# Altium schematic sheet C-metr_analog.SchDoc
size 800 x 500 mm
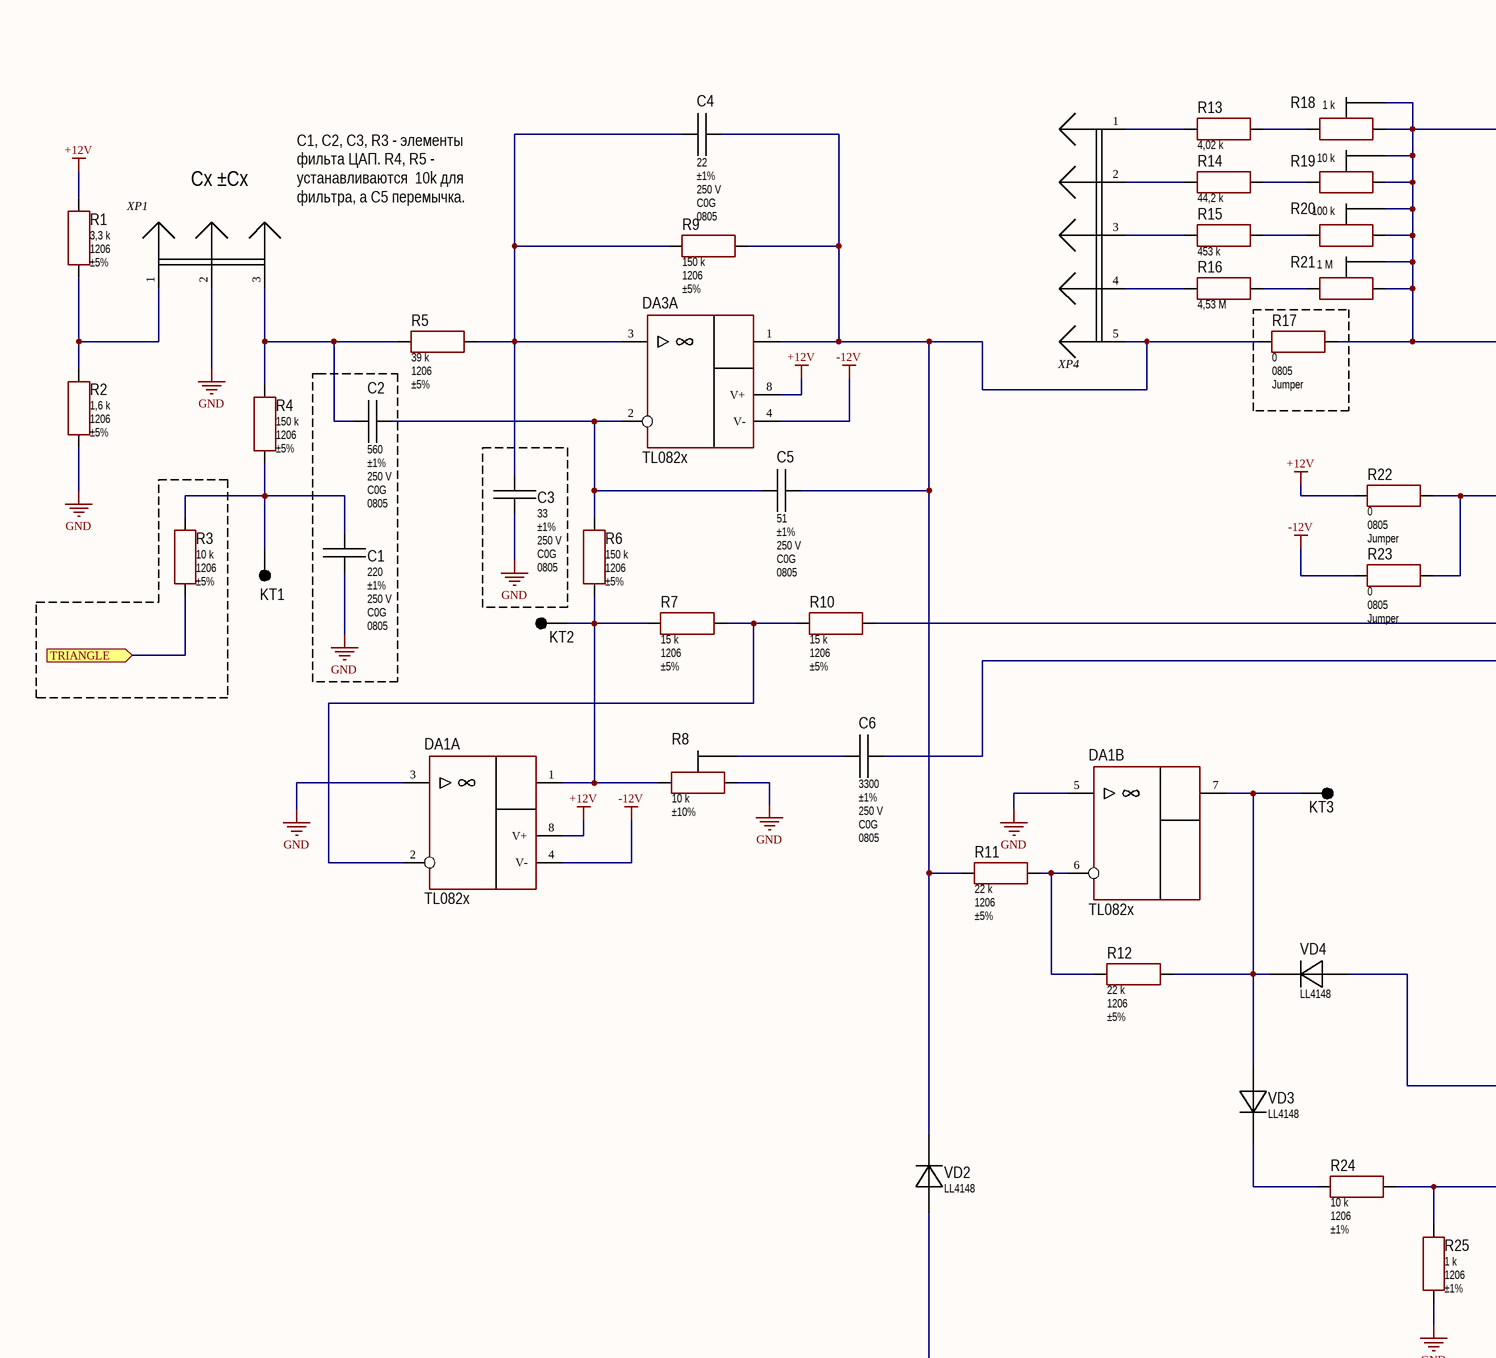
[diagram p0: C-metr_analog.SchDoc, top left]
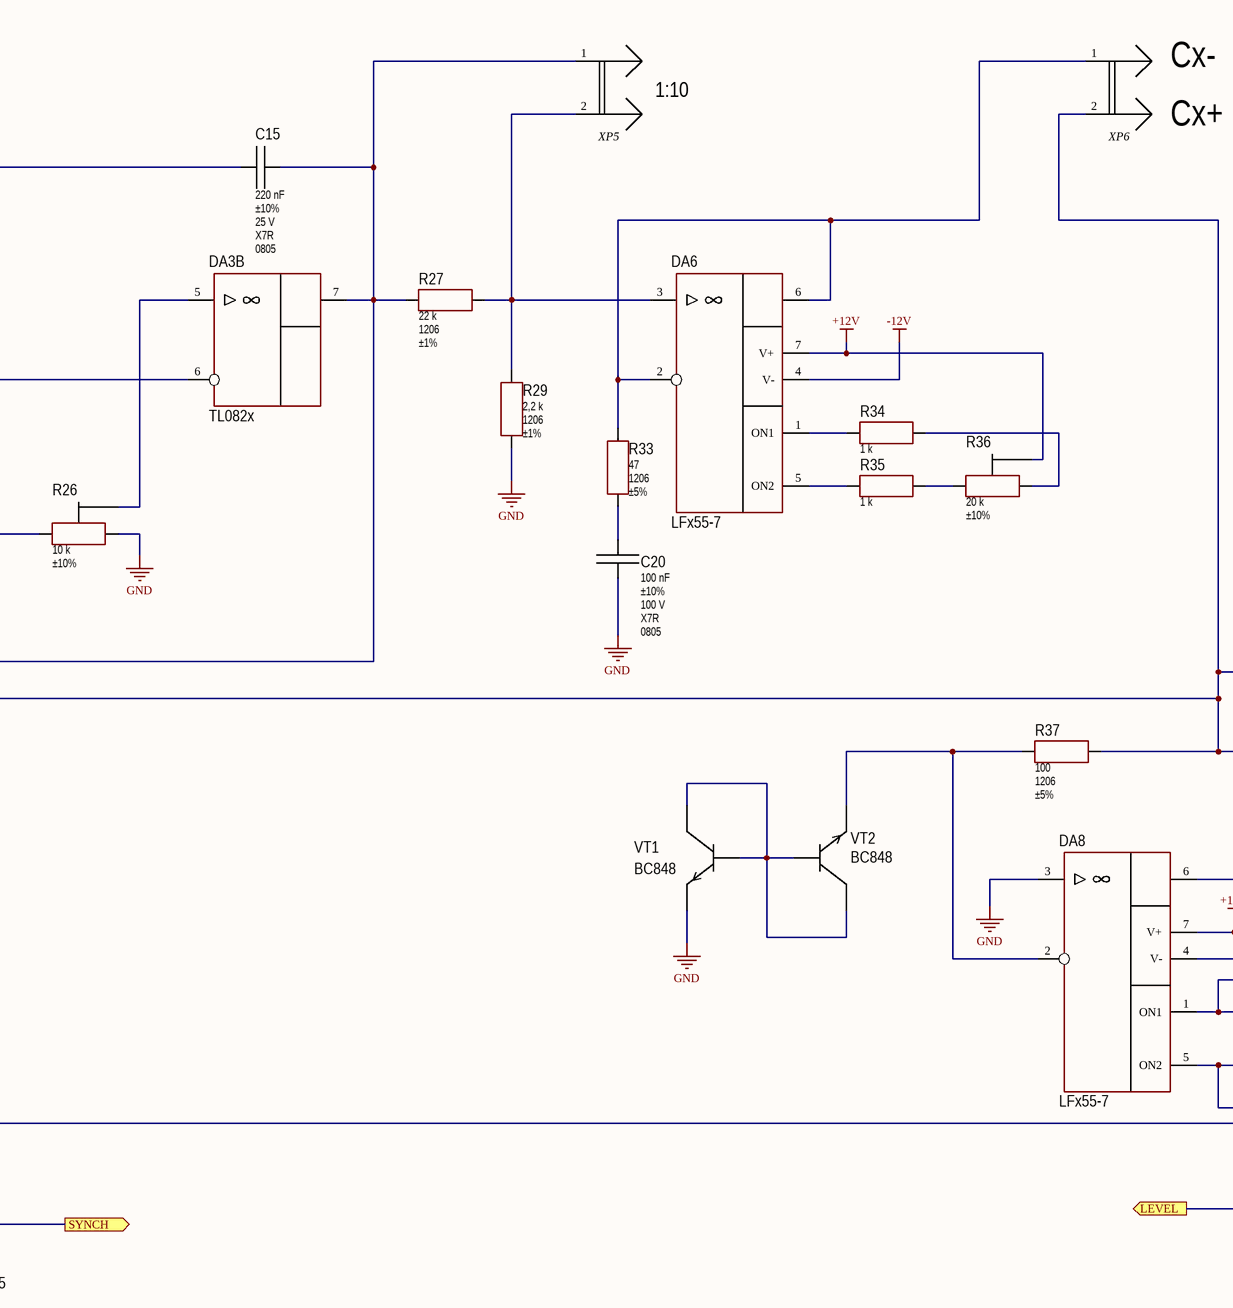
[diagram p1: C-metr_analog.SchDoc, top middle]
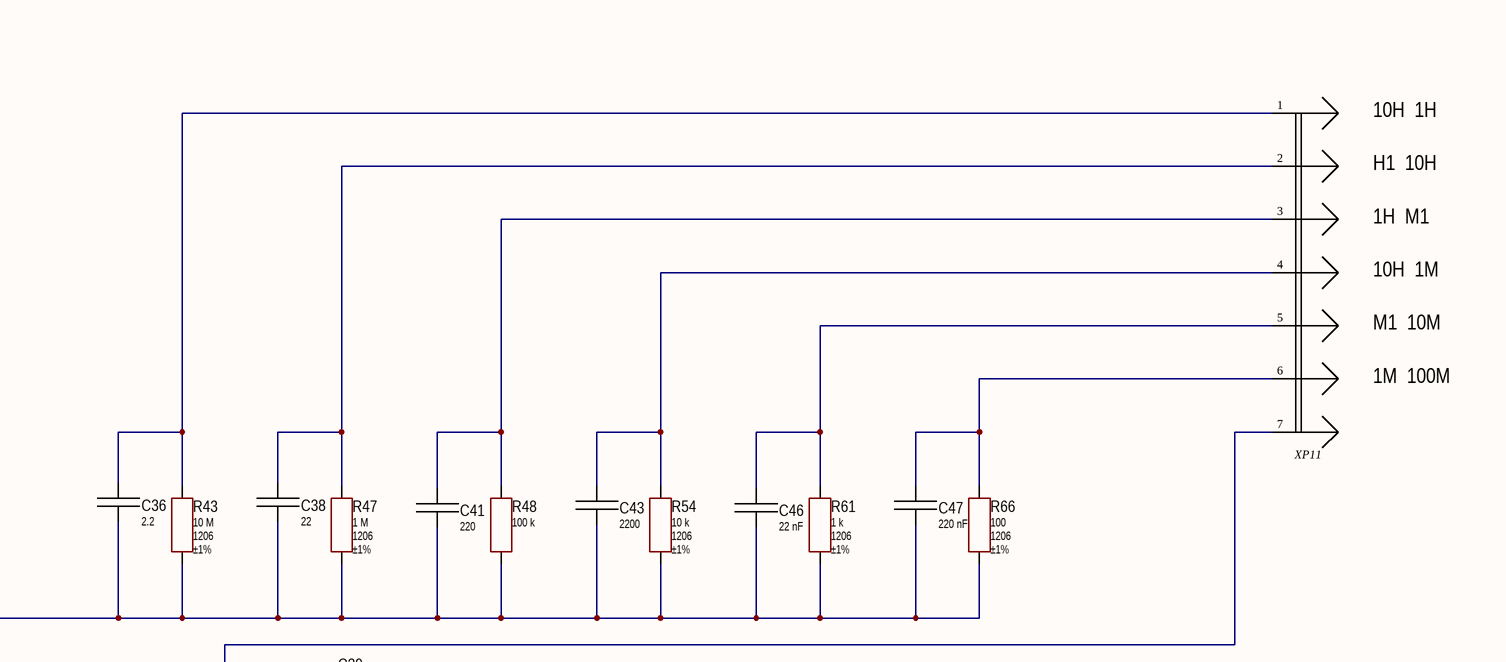
[diagram p2: C-metr_analog.SchDoc, top right]
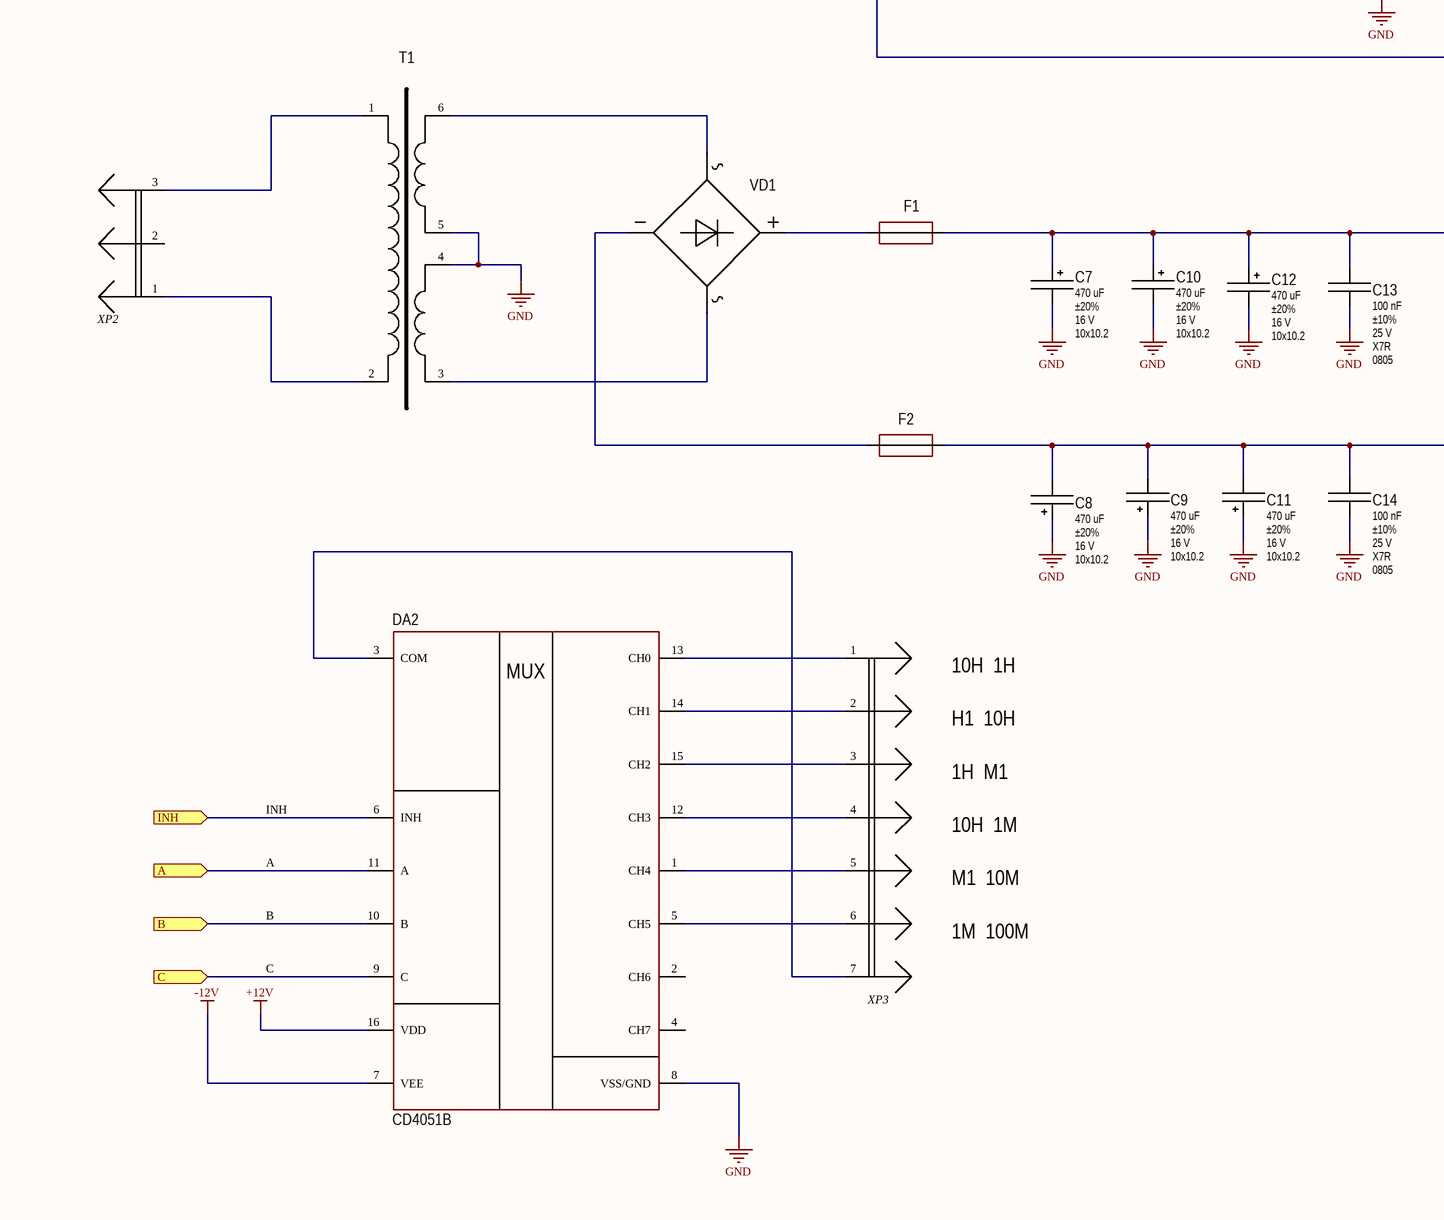
[diagram p3: C-metr_analog.SchDoc, bottom left]
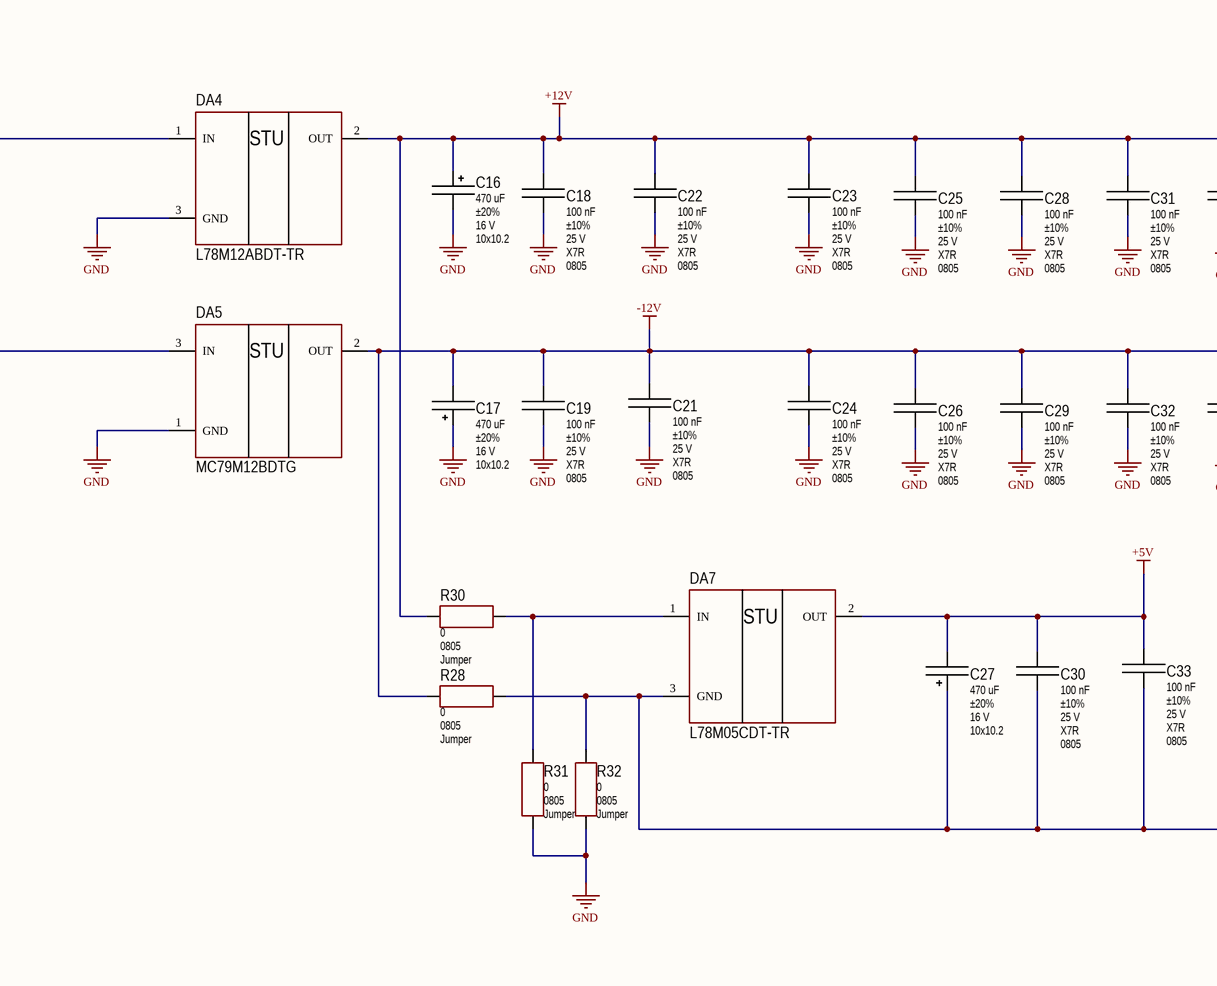
[diagram p4: C-metr_analog.SchDoc, bottom middle]
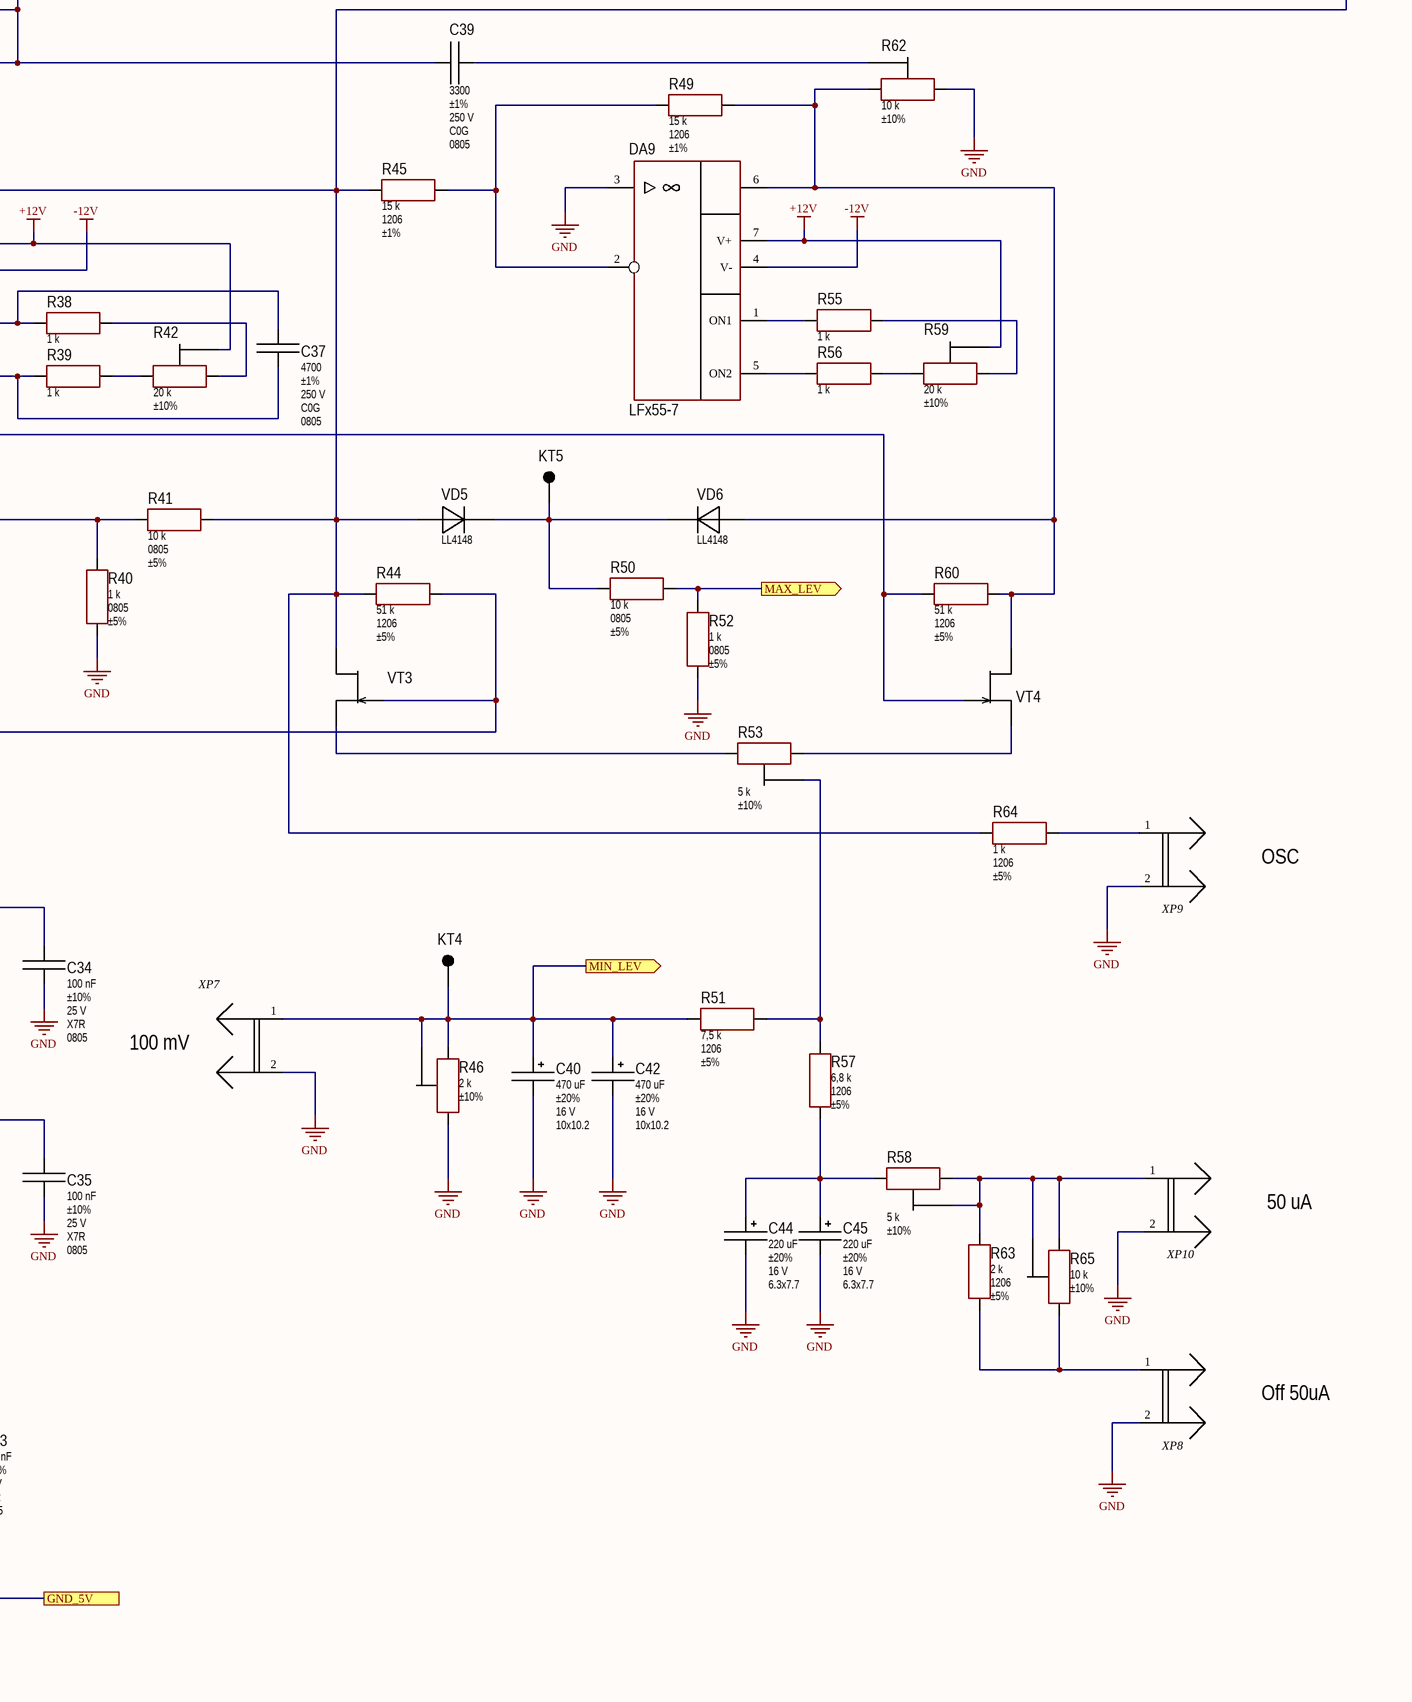
[diagram p5: C-metr_analog.SchDoc, bottom right]

## Parts
C1  Tolerance: ±1%  Voltage: 250 V  Dielectric: C0G  Case: 0805  [C-0805-1.0]  (hidden comment: 220)
C2  Tolerance: ±1%  Voltage: 250 V  Dielectric: C0G  Case: 0805  [C-0805-1.0]  (hidden comment: 560)
C3  Tolerance: ±1%  Voltage: 250 V  Dielectric: C0G  Case: 0805  [C-0805-1.0]  (hidden comment: 33)
C4  Tolerance: ±1%  Voltage: 250 V  Dielectric: C0G  Case: 0805  [C-0805-1.0]  (hidden comment: 22)
C5  Tolerance: ±1%  Voltage: 250 V  Dielectric: C0G  Case: 0805  [C-0805-1.0]  (hidden comment: 51)
C6  Tolerance: ±1%  Voltage: 250 V  Dielectric: C0G  Case: 0805  [C-0805-1.25]  (hidden comment: 3300)
C7  470 uF  Tolerance: ±20%  Voltage: 16 V  Case: 10x10.2  [CAP-CASE G]
C8  470 uF  Tolerance: ±20%  Voltage: 16 V  Case: 10x10.2  [CAP-CASE G]
C9  470 uF  Tolerance: ±20%  Voltage: 16 V  Case: 10x10.2  [CAP-CASE G]
C10  470 uF  Tolerance: ±20%  Voltage: 16 V  Case: 10x10.2  [CAP-CASE G]
C11  470 uF  Tolerance: ±20%  Voltage: 16 V  Case: 10x10.2  [CAP-CASE G]
C12  470 uF  Tolerance: ±20%  Voltage: 16 V  Case: 10x10.2  [CAP-CASE G]
C13  Tolerance: ±10%  Voltage: 25 V  Dielectric: X7R  Case: 0805  [C-0805-0.95]  (hidden comment: 100 nF)
C14  Tolerance: ±10%  Voltage: 25 V  Dielectric: X7R  Case: 0805  [C-0805-0.95]  (hidden comment: 100 nF)
C15  Tolerance: ±10%  Voltage: 25 V  Dielectric: X7R  Case: 0805  [C-0805-0.95]  (hidden comment: 220 nF)
C16  470 uF  Tolerance: ±20%  Voltage: 16 V  Case: 10x10.2  [CAP-CASE G]
C17  470 uF  Tolerance: ±20%  Voltage: 16 V  Case: 10x10.2  [CAP-CASE G]
C18  Tolerance: ±10%  Voltage: 25 V  Dielectric: X7R  Case: 0805  [C-0805-0.95]  (hidden comment: 100 nF)
C19  Tolerance: ±10%  Voltage: 25 V  Dielectric: X7R  Case: 0805  [C-0805-0.95]  (hidden comment: 100 nF)
C20  Tolerance: ±10%  Voltage: 100 V  Dielectric: X7R  Case: 0805  [C-0805-1.25]  (hidden comment: 100 nF)
C21  Tolerance: ±10%  Voltage: 25 V  Dielectric: X7R  Case: 0805  [C-0805-0.95]  (hidden comment: 100 nF)
C22  Tolerance: ±10%  Voltage: 25 V  Dielectric: X7R  Case: 0805  [C-0805-0.95]  (hidden comment: 100 nF)
C23  Tolerance: ±10%  Voltage: 25 V  Dielectric: X7R  Case: 0805  [C-0805-0.95]  (hidden comment: 100 nF)
C24  Tolerance: ±10%  Voltage: 25 V  Dielectric: X7R  Case: 0805  [C-0805-0.95]  (hidden comment: 100 nF)
C25  Tolerance: ±10%  Voltage: 25 V  Dielectric: X7R  Case: 0805  [C-0805-0.95]  (hidden comment: 100 nF)
C26  Tolerance: ±10%  Voltage: 25 V  Dielectric: X7R  Case: 0805  [C-0805-0.95]  (hidden comment: 100 nF)
C27  470 uF  Tolerance: ±20%  Voltage: 16 V  Case: 10x10.2  [CAP-CASE G]
C28  Tolerance: ±10%  Voltage: 25 V  Dielectric: X7R  Case: 0805  [C-0805-0.95]  (hidden comment: 100 nF)
C29  Tolerance: ±10%  Voltage: 25 V  Dielectric: X7R  Case: 0805  [C-0805-0.95]  (hidden comment: 100 nF)
C30  Tolerance: ±10%  Voltage: 25 V  Dielectric: X7R  Case: 0805  [C-0805-0.95]  (hidden comment: 100 nF)
C31  Tolerance: ±10%  Voltage: 25 V  Dielectric: X7R  Case: 0805  [C-0805-0.95]  (hidden comment: 100 nF)
C32  Tolerance: ±10%  Voltage: 25 V  Dielectric: X7R  Case: 0805  [C-0805-0.95]  (hidden comment: 100 nF)
C33  Tolerance: ±10%  Voltage: 25 V  Dielectric: X7R  Case: 0805  [C-0805-0.95]  (hidden comment: 100 nF)
C34  Tolerance: ±10%  Voltage: 25 V  Dielectric: X7R  Case: 0805  [C-0805-0.95]  (hidden comment: 100 nF)
C35  Tolerance: ±10%  Voltage: 25 V  Dielectric: X7R  Case: 0805  [C-0805-0.95]  (hidden comment: 100 nF)
C36  2.2  [C-0805-1.0]
C37  Tolerance: ±1%  Voltage: 250 V  Dielectric: C0G  Case: 0805  [C-0805-1.25]  (hidden comment: 4700)
C38  22  [C-0805-1.0]
C39  Tolerance: ±1%  Voltage: 250 V  Dielectric: C0G  Case: 0805  [C-0805-1.25]  (hidden comment: 3300)
C40  470 uF  Tolerance: ±20%  Voltage: 16 V  Case: 10x10.2  [CAP-CASE G]
C41  220  [C-0805-1.0]
C42  470 uF  Tolerance: ±20%  Voltage: 16 V  Case: 10x10.2  [CAP-CASE G]
C43  2200  [C-0805-1.0]
C44  220 uF  Tolerance: ±20%  Voltage: 16 V  Case: 6.3x7.7  [CAP-CASE D8]
C45  220 uF  Tolerance: ±20%  Voltage: 16 V  Case: 6.3x7.7  [CAP-CASE D8]
C46  22 nF  [C-0805-1.25]
C47  220 nF  [C-0805-0.95]
DA1  TL082x  [DIP-8]  (parts A,B of 2)
DA2  CD4051B  [SOIC-16]
DA3  TL082x  [DIP-8]  (parts A,B of 2)
DA4  L78M12ABDT-TR  [DPAK]
DA5  MC79M12BDTG  [DPAK]
DA6  LFx55-7  [DIP-8]
DA7  L78M05CDT-TR  [DPAK]
DA8  LFx55-7  [DIP-8]
DA9  LFx55-7  [DIP-8]
F1  Fuse  [F-0805]  (value not drawn)
F2  Fuse  [F-0805]  (value not drawn)
KT1  Лепесток 2-1,2-3,0-7-Л63-07  [AGE.271441.002-05]  (value not drawn)
KT2  Лепесток 2-1,2-3,0-7-Л63-07  [AGE.271441.002-05]  (value not drawn)
KT3  Лепесток 2-1,2-3,0-7-Л63-07  [AGE.271441.002-05]  (value not drawn)
KT4  Лепесток 2-1,2-3,0-7-Л63-07  [AGE.271441.002-05]  (value not drawn)
KT5  Лепесток 2-1,2-3,0-7-Л63-07  [AGE.271441.002-05]  (value not drawn)
R1  Case: 1206  Tolerance: ±5%  [R-1206]  (hidden comment: 3,3 k)
R2  Case: 1206  Tolerance: ±5%  [R-1206]  (hidden comment: 1,6 k)
R3  Case: 1206  Tolerance: ±5%  [R-1206]  (hidden comment: 10 k)
R4  Case: 1206  Tolerance: ±5%  [R-1206]  (hidden comment: 150 k)
R5  Case: 1206  Tolerance: ±5%  [R-1206]  (hidden comment: 39 k)
R6  Case: 1206  Tolerance: ±5%  [R-1206]  (hidden comment: 150 k)
R7  Case: 1206  Tolerance: ±5%  [R-1206]  (hidden comment: 15 k)
R8  Tolerance: ±10%  [3296W]  (hidden comment: 10 k)
R9  Case: 1206  Tolerance: ±5%  [R-1206]  (hidden comment: 150 k)
R10  Case: 1206  Tolerance: ±5%  [R-1206]  (hidden comment: 15 k)
R11  Case: 1206  Tolerance: ±5%  [R-1206]  (hidden comment: 22 k)
R12  Case: 1206  Tolerance: ±5%  [R-1206]  (hidden comment: 22 k)
R13  4,02 k  [R-1206]
R14  44,2 k  [R-1206]
R15  453 k  [R-1206]
R16  4,53 M  [R-1206]
R17  Case: 0805  Tolerance: Jumper  [R-0805]  (hidden comment: 0)
R18  1 k  [3296W]
R19  10 k  [3296W]
R20  100 k  [3296W]
R21  1 M  [3296W]
R22  Case: 0805  Tolerance: Jumper  [R-0805]  (hidden comment: 0)
R23  Case: 0805  Tolerance: Jumper  [R-0805]  (hidden comment: 0)
R24  Case: 1206  Tolerance: ±1%  [R-1206]  (hidden comment: 10 k)
R25  Case: 1206  Tolerance: ±1%  [R-1206]  (hidden comment: 1 k)
R26  Tolerance: ±10%  [3296W]  (hidden comment: 10 k)
R27  Case: 1206  Tolerance: ±1%  [R-1206]  (hidden comment: 22 k)
R28  Case: 0805  Tolerance: Jumper  [R-0805]  (hidden comment: 0)
R29  Case: 1206  Tolerance: ±1%  [R-1206]  (hidden comment: 2,2 k)
R30  Case: 0805  Tolerance: Jumper  [R-0805]  (hidden comment: 0)
R31  Case: 0805  Tolerance: Jumper  [R-0805]  (hidden comment: 0)
R32  Case: 0805  Tolerance: Jumper  [R-0805]  (hidden comment: 0)
R33  Case: 1206  Tolerance: ±5%  [R-1206]  (hidden comment: 47)
R34  1 k  [R-1206]
R35  1 k  [R-1206]
R36  Tolerance: ±10%  [3296W]  (hidden comment: 20 k)
R37  Case: 1206  Tolerance: ±5%  [R-1206]  (hidden comment: 100)
R38  1 k  [R-1206]
R39  1 k  [R-1206]
R40  Case: 0805  Tolerance: ±5%  [R-0805]  (hidden comment: 1 k)
R41  Case: 0805  Tolerance: ±5%  [R-0805]  (hidden comment: 10 k)
R42  Tolerance: ±10%  [3296W]  (hidden comment: 20 k)
R43  Case: 1206  Tolerance: ±1%  [R-1206]  (hidden comment: 10 M)
R44  Case: 1206  Tolerance: ±5%  [R-1206]  (hidden comment: 51 k)
R45  Case: 1206  Tolerance: ±1%  [R-1206]  (hidden comment: 15 k)
R46  Tolerance: ±10%  [3296W]  (hidden comment: 2 k)
R47  Case: 1206  Tolerance: ±1%  [R-1206]  (hidden comment: 1 M)
R48  100 k  [R-1206]
R49  Case: 1206  Tolerance: ±1%  [R-1206]  (hidden comment: 15 k)
R50  Case: 0805  Tolerance: ±5%  [R-0805]  (hidden comment: 10 k)
R51  Case: 1206  Tolerance: ±5%  [R-1206]  (hidden comment: 7,5 k)
R52  Case: 0805  Tolerance: ±5%  [R-0805]  (hidden comment: 1 k)
R53  Tolerance: ±10%  [3296W]  (hidden comment: 5 k)
R54  Case: 1206  Tolerance: ±1%  [R-1206]  (hidden comment: 10 k)
R55  1 k  [R-1206]
R56  1 k  [R-1206]
R57  Case: 1206  Tolerance: ±5%  [R-1206]  (hidden comment: 6,8 k)
R58  Tolerance: ±10%  [3296W]  (hidden comment: 5 k)
R59  Tolerance: ±10%  [3296W]  (hidden comment: 20 k)
R60  Case: 1206  Tolerance: ±5%  [R-1206]  (hidden comment: 51 k)
R61  Case: 1206  Tolerance: ±1%  [R-1206]  (hidden comment: 1 k)
R62  Tolerance: ±10%  [3296W]  (hidden comment: 10 k)
R63  Case: 1206  Tolerance: ±5%  [R-1206]  (hidden comment: 2 k)
R64  Case: 1206  Tolerance: ±5%  [R-1206]  (hidden comment: 1 k)
R65  Tolerance: ±10%  [3296W]  (hidden comment: 10 k)
R66  Case: 1206  Tolerance: ±1%  [R-1206]  (hidden comment: 100)
T1  1P2S  [TH30/12G]  (value not drawn)
VD1  Brige  [DB-S]  (value not drawn)
VD2  LL4148  [SOD-80]
VD3  LL4148  [SOD-80]
VD4  LL4148  [SOD-80]
VD5  LL4148  [SOD-80]
VD6  LL4148  [SOD-80]
VT1  BC848  [SOT-23]
VT2  BC848  [SOT-23]
VT3  JFET-N  [SOT-23]  (value not drawn)
VT4  JFET-N  [SOT-23]  (value not drawn)
XP1  Text  [61300311121]  (value not drawn)
XP2  Text  [61900311121]  (value not drawn)
XP3  Text  [61300711121]  (value not drawn)
XP4  Text  [61300511121]  (value not drawn)
XP5  Text  [61300211121]  (value not drawn)
XP6  Text  [61300211121]  (value not drawn)
XP7  Text  [61300211121]  (value not drawn)
XP8  Text  [61300211121]  (value not drawn)
XP9  Text  [61300211121]  (value not drawn)
XP10  Text  [61300211121]  (value not drawn)
XP11  Text  [61300711121]  (value not drawn)

## Ports
A (in), B (in), C (in), GND_5V, INH (in), LEVEL (out), MAX_LEV (out), MIN_LEV (out), SYNCH (out), TRIANGLE (in)

## Nets
+5V: C27.2 C30.2 C33.2 DA7.2(OUT)
+12V: C16.1 C18.2 C22.2 C23.2 C25.2 C28.2 C31.2 C34.2 DA1.8(V+) DA2.16(VDD) DA3.8(V+) DA4.2(OUT) DA6.7(V+) DA8.7(V+) DA9.7(V+) R1.1 R22.1 R30.2 R36.2 R42.2 R59.2
-12V: C17.2 C19.2 C21.2 C24.2 C26.2 C29.2 C32.2 C35.1 DA1.4(V-) DA2.7(VEE) DA3.4(V-) DA5.2(OUT) DA6.4(V-) DA8.4(V-) DA9.4(V-) R23.1 R28.1
GND: C1.1 C3.1 C7.2 C8.1 C9.1 C10.2 C11.1 C12.2 C13.1 C14.1 C16.2 C17.1 C18.1 C19.1 C20.1 C21.1 C22.1 C23.1 C24.1 C25.1 C26.1 C28.1 C29.1 C31.1 C32.1 C34.1 C35.2 C40.2 C42.2 C44.2 C45.2 DA1.3(+IN) DA1.5(+IN) DA2.8(VSS/GND) DA4.3(GND) DA5.1(GND) DA8.3(+IN) DA9.3(+IN) R2.1 R8.3 R25.1 R26.3 R29.1 R31.1 R32.1 R40.1 R46.1 R52.1 R62.1 T1.4 T1.5 VT1.2 XP1.2 XP7.2 XP8.2 XP9.2 XP10.2
A: DA2.11(A) ; port A
B: DA2.10(B) ; port B
C: DA2.9(C) ; port C
GND_5V: C27.1 C30.1 C33.1 DA7.3(GND) R28.2 R32.2 ; port GND_5V
INH: DA2.6(INH) ; port INH
LEVEL: R40.2 R41.1 ; port LEVEL
MAX_LEV: R50.1 R52.2 ; port MAX_LEV
MIN_LEV: C40.1 C42.1 KT4.1 R46.2 R46.3 R51.1 XP7.1 ; port MIN_LEV
SYNCH: R24.1 R25.2 ; port SYNCH
TRIANGLE: R3.1 ; port TRIANGLE
NetC1_2: C1.2 KT1.1 R3.2 R4.2
NetC2_1: C2.1 R4.1 R5.1 XP1.3
NetC2_2: C2.2 C5.2 DA3.2(-IN) R6.1
NetC3_2: C3.2 C4.1 DA3.3(+IN) R5.2 R9.1
NetC4_2: C4.2 C5.1 DA3.1(OUT) R9.2 R11.1 R17.1 VD2.2 XP4.5
NetC6_1: C6.1 R8.2
NetC6_2: C6.2 C36.1 C38.1 C39.1 C41.2 C43.2 C46.2 C47.2 R37.2 R43.1 R47.1 R48.2 R54.1 R61.1 R66.2 XP6.2
NetC7_1: C7.1 C10.1 C12.1 C13.2 DA4.1(IN) F1.2
NetC8_2: C8.2 C9.2 C11.2 C14.2 DA5.3(IN) F2.2
NetC15_1: C15.1 DA3.6(-IN) R17.2 R18.2 R18.3 R19.2 R19.3 R20.2 R20.3 R21.2 R21.3
NetC15_2: C15.2 DA3.7(OUT) R10.2 R27.1 XP5.1
NetC20_2: C20.2 R33.2
NetC36_2: C36.2 R43.2 XP11.1
NetC37_1: C37.1 DA8.5(ON2) R39.1
NetC37_2: C37.2 DA8.1(ON1) R38.1
NetC38_2: C38.2 R47.2 XP11.2
NetC39_2: C39.2 R62.2
NetC41_1: C41.1 R48.1 XP11.3
NetC43_1: C43.1 R54.2 XP11.4
NetC44_1: C44.1 C45.1 R57.1 R58.1
NetC46_1: C46.1 R61.2 XP11.5
NetC47_1: C47.1 R66.1 XP11.6
NetDA1_1: DA1.1(OUT) KT2.1 R6.2 R7.1 R8.1
NetDA1_2: DA1.2(-IN) R7.2 R10.1
NetDA1_6: DA1.6(-IN) R11.2 R12.1
NetDA1_7: DA1.7(OUT) KT3.1 R12.2 VD3.1 VD4.2
NetDA2_1: DA2.1(CH4) XP3.5
NetDA2_3: DA2.3(COM) XP3.7
NetDA2_5: DA2.5(CH5) XP3.6
NetDA2_12: DA2.12(CH3) XP3.4
NetDA2_13: DA2.13(CH0) XP3.1
NetDA2_14: DA2.14(CH1) XP3.2
NetDA2_15: DA2.15(CH2) XP3.3
NetDA3_5: DA3.5(+IN) R26.2
NetDA6_1: DA6.1(ON1) R34.1
NetDA6_2: DA6.2(-IN) DA6.6(OUT) R33.1 XP6.1
NetDA6_3: DA6.3(+IN) R27.2 R29.2 XP5.2
NetDA6_5: DA6.5(ON2) R35.1
NetDA7_1: DA7.1(IN) R30.1 R31.2
NetDA8_2: DA8.2(-IN) R37.1 VT2.2
NetDA8_6: DA8.6(OUT) R41.2 R44.1 R45.1 R64.1 VD5.1 VT3.2(D) XP11.7
NetDA9_1: DA9.1(ON1) R55.1
NetDA9_2: DA9.2(-IN) R45.2 R49.1
NetDA9_5: DA9.5(ON2) R56.1
NetDA9_6: DA9.6(OUT) R49.2 R60.2 R62.3 VD6.1 VT4.2(D)
NetF1_1: F1.1 VD1.3
NetF2_1: F2.1 VD1.1
NetKT5_1: KT5.1 R50.2 VD5.2 VD6.2
NetR1_2: R1.2 R2.2 XP1.1
NetR13_1: R13.1 XP4.1
NetR13_2: R13.2 R18.1
NetR14_1: R14.1 XP4.2
NetR14_2: R14.2 R19.1
NetR15_1: R15.1 XP4.3
NetR15_2: R15.2 R20.1
NetR16_1: R16.1 XP4.4
NetR16_2: R16.2 R21.1
NetR22_2: R22.2 R23.2 R26.1
NetR24_2: R24.2 VD3.2
NetR34_2: R34.2 R36.3
NetR35_2: R35.2 R36.1
NetR38_2: R38.2 R42.3
NetR39_2: R39.2 R42.1
NetR44_2: R44.2 VD2.1 VT3.3(G)
NetR51_2: R51.2 R53.2 R57.2
NetR53_1: R53.1 VT3.1(S)
NetR53_3: R53.3 VT4.1(S)
NetR55_2: R55.2 R59.3
NetR56_2: R56.2 R59.1
NetR58_2: R58.2 R58.3 R63.2 R65.2 R65.3 XP10.1
NetR60_1: R60.1 VD4.1 VT4.3(G)
NetR63_1: R63.1 R65.1 XP8.1
NetR64_2: R64.2 XP9.1
NetT1_1: T1.1 XP2.3
NetT1_2: T1.2 XP2.1
NetT1_3: T1.3 VD1.4
NetT1_6: T1.6 VD1.2
NetVT1_1: VT1.1 VT1.3 VT2.1 VT2.3

Not connected (* = marked no-connect by the designer): DA2 2(CH6) 4(CH7); XP2 2

## Notes on the sheet
- Cx-
- (near XP5) 1:10
- Cx+
- 10Н  1Н
- Cx ±Cx
- Н1  10Н
- (near XP1) C1, C2, C3, R3 - элементы фильта ЦАП. R4, R5 - устанавливаются  10k для фильтра, а С5 перемычка.
- 1Н  M1
- 10Н  1M
- M1  10M
- 1M  100M
- OSC
- 100 mV
- 50 uA
- Off 50uA
- (in symbol CD4051BM) MUX
- (in symbol L78M05CDT-TR) STU
- (in symbol L78M12ABDT-TR) STU
- (in symbol MC79M12BDTG) STU

## Library data of the parts
C1 = GRM21A5C2E221FW01D: Manufacturer: Murata Electronics; Type: Конденсатор; Units: pF; Value+Units: 220 pF; CommentDOC: ( GRM - 0805 - C0G - 250 V - 220 pF ±1% ); ValueSCH: 220; Part Number: GRM21A5C2E221FW01D; Value: 220; Operating Temperature: -55 ... 125 °C; Series: GRM; ( Series - Case - Dielectric -  Voltage - Value+Units Tolerance: ( GRM - 0805 - C0G - 250 V - 220 pF ±1% )
C2 = GRM21A5C2E561FW01D: Manufacturer: Murata Electronics; Type: Конденсатор; Units: pF; Value+Units: 560 pF; CommentDOC: ( GRM - 0805 - C0G - 250 V - 560 pF ±1% ); ValueSCH: 560; Part Number: GRM21A5C2E561FW01D; Value: 560; Operating Temperature: -55 ... 125 °C; Series: GRM; ( Series - Case - Dielectric -  Voltage - Value+Units Tolerance: ( GRM - 0805 - C0G - 250 V - 560 pF ±1% )
C3 = GRM21A5C2E330FW01D: Manufacturer: Murata Electronics; Type: Конденсатор; Units: pF; Value+Units: 33 pF; CommentDOC: ( GRM - 0805 - C0G - 250 V - 33 pF ±1% ); ValueSCH: 33; Part Number: GRM21A5C2E330FW01D; Value: 33; Operating Temperature: -55 ... 125 °C; Series: GRM; ( Series - Case - Dielectric -  Voltage - Value+Units Tolerance: ( GRM - 0805 - C0G - 250 V - 33 pF ±1% )
C4 = GRM21A5C2E220FW01D: Manufacturer: Murata Electronics; Type: Конденсатор; Units: pF; Value+Units: 22 pF; CommentDOC: ( GRM - 0805 - C0G - 250 V - 22 pF ±1% ); ValueSCH: 22; Part Number: GRM21A5C2E220FW01D; Value: 22; Operating Temperature: -55 ... 125 °C; Series: GRM; ( Series - Case - Dielectric -  Voltage - Value+Units Tolerance: ( GRM - 0805 - C0G - 250 V - 22 pF ±1% )
C5 = GRM21A5C2E151FW01D: Manufacturer: Murata Electronics; Type: Конденсатор; Value: 150; Units: pF; Value+Units: 150 pF; CommentDOC: ( GRM - 0805 - C0G - 250 V - 150 pF ±1% ); ValueSCH: 51; Part Number: GRM21A5C2E151FW01D; Operating Temperature: -55 ... 125 °C; Series: GRM; ( Series - Case - Dielectric -  Voltage - Value+Units Tolerance: ( GRM - 0805 - C0G - 250 V - 150 pF ±1% )
C6 C39 = GRM21B5C2E332FW01D: Manufacturer: Murata Electronics; Type: Конденсатор; Units: pF; Value+Units: 3300 pF; CommentDOC: ( GRM - 0805 - C0G - 250 V - 3300 pF ±1% ); ValueSCH: 3300; Part Number: GRM21B5C2E332FW01D; Value: 3300; Operating Temperature: -55 ... 125 °C; Series: GRM; ( Series - Case - Dielectric -  Voltage - Value+Units Tolerance: ( GRM - 0805 - C0G - 250 V - 3300 pF ±1% )
C7-C12 C16 C17 C27 C40 C42 = EEE-1CA471P: Manufacturer: Panasonic Electronic Components; Type: Конденсатор; Value: 470; CommentDOC: ( S - 16 V - 470  uF  ±20% ); Part Number: EEE-1CA471P; Units: uF; Operating Temperature: -40 ... 85 °C; Series: S; ValueSCH: 470 uF; ( Series - Voltage - Value  Units  Tolerance ): ( S - 16 V - 470  uF  ±20% )
C13 C14 C18 C19 C21-C26 C28-C35 = CC0805KRX7R8BB104: Manufacturer: Yageo; Type: Конденсатор; Value: 100; CommentDOC: ( CC - 0805 - X7R - 25 V - 100 nF ±10% ); ValueSCH: 100 nF; Part Number: CC0805KRX7R8BB104; Units: nF; Operating Temperature: -55 ... 125 °C; Series: CC; Value+Units: 100 nF; ( Series - Case - Dielectric -  Voltage - Value+Units Tolerance: ( CC - 0805 - X7R - 25 V - 100 nF ±10% )
C15 = CC0805KRX7R8BB224: Manufacturer: Yageo; Type: Конденсатор; Value: 220; CommentDOC: ( CC - 0805 - X7R - 25 V - 220 nF ±10% ); ValueSCH: 220 nF; Part Number: CC0805KRX7R8BB224; Units: nF; Operating Temperature: -55 ... 125 °C; Series: CC; Value+Units: 220 nF; ( Series - Case - Dielectric -  Voltage - Value+Units Tolerance: ( CC - 0805 - X7R - 25 V - 220 nF ±10% )
C20 = GCM21BR72A104KA37L: Manufacturer: Murata Electronics; Type: Конденсатор; Value: 100; CommentDOC: ( GCM - 0805 - X7R - 100 V - 100 nF ±10% ); ValueSCH: 100 nF; Part Number: GCM21BR72A104KA37L; Units: nF; Operating Temperature: -55 ... 125 °C; Series: GCM; Value+Units: 100 nF; ( Series - Case - Dielectric -  Voltage - Value+Units Tolerance: ( GCM - 0805 - X7R - 100 V - 100 nF ±10% )
C36 = GRM21A5C2E220FW01D: Manufacturer: Murata Electronics; Type: Конденсатор; Tolerance: ±1%; Voltage: 250 V; Dielectric: C0G; Value: 22; Units: pF; Value+Units: 22 pF; CommentDOC: ( GRM - 0805 - C0G - 250 V - 22 pF ±1% ); ValueSCH: 2.2; Case: 0805; Part Number: GRM21A5C2E220FW01D; Operating Temperature: -55 ... 125 °C; Series: GRM; ( Series - Case - Dielectric -  Voltage - Value+Units Tolerance: ( GRM - 0805 - C0G - 250 V - 22 pF ±1% )
C37 = GRM21B5C2E472FW01D: Manufacturer: Murata Electronics; Type: Конденсатор; Units: pF; Value+Units: 4700 pF; CommentDOC: ( GRM - 0805 - C0G - 250 V - 4700 pF ±1% ); ValueSCH: 4700; Part Number: GRM21B5C2E472FW01D; Value: 4700; Operating Temperature: -55 ... 125 °C; Series: GRM; ( Series - Case - Dielectric -  Voltage - Value+Units Tolerance: ( GRM - 0805 - C0G - 250 V - 4700 pF ±1% )
C38 = GRM21A5C2E220FW01D: Manufacturer: Murata Electronics; Type: Конденсатор; Tolerance: ±1%; Voltage: 250 V; Dielectric: C0G; Units: pF; Value+Units: 22 pF; CommentDOC: ( GRM - 0805 - C0G - 250 V - 22 pF ±1% ); ValueSCH: 22; Case: 0805; Part Number: GRM21A5C2E220FW01D; Value: 22; Operating Temperature: -55 ... 125 °C; Series: GRM; ( Series - Case - Dielectric -  Voltage - Value+Units Tolerance: ( GRM - 0805 - C0G - 250 V - 22 pF ±1% )
C41 = GRM21A5C2E221FW01D: Manufacturer: Murata Electronics; Type: Конденсатор; Tolerance: ±1%; Voltage: 250 V; Dielectric: C0G; Units: pF; Value+Units: 220 pF; CommentDOC: ( GRM - 0805 - C0G - 250 V - 220 pF ±1% ); ValueSCH: 220; Case: 0805; Part Number: GRM21A5C2E221FW01D; Value: 220; Operating Temperature: -55 ... 125 °C; Series: GRM; ( Series - Case - Dielectric -  Voltage - Value+Units Tolerance: ( GRM - 0805 - C0G - 250 V - 220 pF ±1% )
C43 = GRM21A5C2E222FW01D: Manufacturer: Murata Electronics; Type: Конденсатор; Tolerance: ±1%; Voltage: 250 V; Dielectric: C0G; Units: pF; Value+Units: 2200 pF; CommentDOC: ( GRM - 0805 - C0G - 250 V - 2200 pF ±1% ); ValueSCH: 2200; Case: 0805; Part Number: GRM21A5C2E222FW01D; Value: 2200; Operating Temperature: -55 ... 125 °C; Series: GRM; ( Series - Case - Dielectric -  Voltage - Value+Units Tolerance: ( GRM - 0805 - C0G - 250 V - 2200 pF ±1% )
C44 C45 = EEE-1CA221XP: Manufacturer: Panasonic Electronic Components; Type: Конденсатор; Value: 220; CommentDOC: ( S - 16 V - 220  uF  ±20% ); Part Number: EEE-1CA221XP; Units: uF; Operating Temperature: -40 ... 85 °C; Series: S; ValueSCH: 220 uF; ( Series - Voltage - Value  Units  Tolerance ): ( S - 16 V - 220  uF  ±20% )
C46 = GCM21B5C1H223JA16L: Manufacturer: Murata Electronics; Type: Конденсатор; Tolerance: ±5%; Voltage: 50 V; Dielectric: C0G; Value: 22; CommentDOC: ( GCM - 0805 - C0G - 50 V - 22 nF ±5% ); ValueSCH: 22 nF; Case: 0805; Part Number: GCM21B5C1H223JA16L; Units: nF; Operating Temperature: -55 ... 125 °C; Series: GCM; Value+Units: 22 nF; ( Series - Case - Dielectric -  Voltage - Value+Units Tolerance: ( GCM - 0805 - C0G - 50 V - 22 nF ±5% )
C47 = CC0805KRX7R8BB224: Manufacturer: Yageo; Type: Конденсатор; Tolerance: ±10%; Voltage: 25 V; Dielectric: X7R; Value: 220; CommentDOC: ( CC - 0805 - X7R - 25 V - 220 nF ±10% ); ValueSCH: 220 nF; Case: 0805; Part Number: CC0805KRX7R8BB224; Units: nF; Operating Temperature: -55 ... 125 °C; Series: CC; Value+Units: 220 nF; ( Series - Case - Dielectric -  Voltage - Value+Units Tolerance: ( CC - 0805 - X7R - 25 V - 220 nF ±10% )
DA1 DA3 = TL062CN: IC OPAMP FET-Input SOIC-8; Manufacturer: STMicroelectronics; Bandwidth: 1 MHz; Voltage  Supply: ±18 V; Part Number: TL062CN; Case: DIP-8; Operating Temperature: 0°С ... 70°С
DA2 = CD4051BM: Manufacturer: Texas  Instruments; Function: IC MULTIPLEXOR 1IN-8OUT; Voltage  Supply: ±20 V; Part Number: CD4051BM; Case: SOIC-16; Operating Temperature: -55 ... 125 °C
DA4 = L78M12ABDT-TR: IC REG LINEAR; Manufacturer: STMicroelectronics; Voltage Output: 12 V; Current Output Max: 500 mA; Voltage Input Max: 35 V; Type: Микросхема; Part Number: L78M12ABDT-TR; ValueSCH: L78M12ABDT-TR; Case: DPAK; Operating Temperature: −40°C ... 125°C
DA5 = MC79M12BDTG: IC REG LINEAR; Voltage Output: `-12 V; Current Output Max: 500 mA; Voltage Input Max: `-35 V; Type: Микросхема; Part Number: MC79M12BDTG; ValueSCH: MC79M12BDTG; Case: DPAK
DA6 DA8 DA9 = LF357N: Part Number: LF357N; Manufacturer: STMicroelectronics; Bandwidth: 20 MHz; Voltage  Supply: ±22 V; Case: DIP-8; Operating Temperature: 0°С ... 70°С
DA7 = L78M05CDT-TR: IC REG LINEAR; Manufacturer: STMicroelectronics; Voltage Output: 5,0 V; Current Output Max: 500 mA; Voltage Input Max: 35 V; Type: Микросхема; Part Number: L78M05CDT-TR; ValueSCH: L78M05CDT-TR; Case: DPAK; Operating Temperature: 0°C ... 150°C
F1 F2 = SMD0805P05TF: Manufacturer: Shenzhen Ruilongyuan Electronics Co., Ttd (RUILON); Value: 0.05 A; Operating Voltage: 15V; Part Number: SMD0805P05TF; Units: 0.05 A; ValueSCH: 0.05 A; Case: 0805; Operating Temperature: -40°C ... 85°C; Series: PTC
KT1-KT5 = Лепесток 2-1,2-3,0-7-Л63-07: Specification: ГОСТ 16840-78; Type: Лепесток; Part Number: Лепесток 2-1,2-3,0-7-Л63-07
R1 = CRCW12063K30JNEA: Manufacturer: Vishay Dale; Functional Analog Manufacturer: Yageo; Power: 0,25 W; Value: 3,3; Units: kOhm; Operating Voltage: 200 V; Value+Units: 3,3 kOhm; CommentDOC: ( CRCW - 1206 - 0,25 W - 3,3 kOhm  ±5% ); Functional Analog: RC1206JR-073K3L; Type: Резистор; ValueSCH: 3,3 k; Part Number: CRCW12063K30JNEA; Operating Temperature: -55°C ... 155°C; Series: CRCW
R2 = CRCW12061K60JNEA: Manufacturer: Vishay Dale; Functional Analog Manufacturer: Yageo; Power: 0,25 W; Value: 1,6; Units: kOhm; Operating Voltage: 200 V; Value+Units: 1,6 kOhm; CommentDOC: ( CRCW - 1206 - 0,25 W - 1,6 kOhm  ±5% ); Functional Analog: RC1206JR-071K6L; Type: Резистор; ValueSCH: 1,6 k; Part Number: CRCW12061K60JNEA; Operating Temperature: -55°C ... 155°C; Series: CRCW
R3 = CRCW120610K0JNEA: Manufacturer: Vishay Dale; Functional Analog Manufacturer: Yageo; Power: 0,25 W; Value: 10; Units: kOhm; Operating Voltage: 200 V; Value+Units: 10 kOhm; CommentDOC: ( CRCW - 1206 - 0,25 W - 10 kOhm  ±5% ); Functional Analog: RC1206JR-0710KL; Type: Резистор; ValueSCH: 10 k; Part Number: CRCW120610K0JNEA; Operating Temperature: -55°C ... 155°C; Series: CRCW
R4 R6 R9 = CRCW1206150KJNEA: Manufacturer: Vishay Dale; Functional Analog Manufacturer: Yageo; Power: 0,25 W; Value: 150; Units: kOhm; Operating Voltage: 200 V; Value+Units: 150 kOhm; CommentDOC: ( CRCW - 1206 - 0,25 W - 150 kOhm  ±5% ); Functional Analog: RC1206JR-07150KL; Type: Резистор; ValueSCH: 150 k; Part Number: CRCW1206150KJNEA; Operating Temperature: -55°C ... 155°C; Series: CRCW
R5 = CRCW120639K0JNEA: Manufacturer: Vishay Dale; Functional Analog Manufacturer: Yageo; Power: 0,25 W; Value: 39; Units: kOhm; Operating Voltage: 200 V; Value+Units: 39 kOhm; CommentDOC: ( CRCW - 1206 - 0,25 W - 39 kOhm  ±5% ); Functional Analog: RC1206JR-0739KL; Type: Резистор; ValueSCH: 39 k; Part Number: CRCW120639K0JNEA; Operating Temperature: -55°C ... 155°C; Series: CRCW
R7 R10 = CRCW120615K0JNEA: Manufacturer: Vishay Dale; Functional Analog Manufacturer: Yageo; Power: 0,25 W; Value: 15; Units: kOhm; Operating Voltage: 200 V; Value+Units: 15 kOhm; CommentDOC: ( CRCW - 1206 - 0,25 W - 15 kOhm  ±5% ); Functional Analog: RC1206JR-0715KL; Type: Резистор; ValueSCH: 15 k; Part Number: CRCW120615K0JNEA; Operating Temperature: -55°C ... 155°C; Series: CRCW
R8 R26 R62 = 3296W-1-103LF: Manufacturer: Bourns Inc.; Power: 0,5 W; Value: 10; Units: kOhm; Value+Units: 10 kOhm; CommentDOC: ( 3296W - 0,5 W - 10 kOhm ±10% ); Type: Резистор; ValueSCH: 10 k; Part Number: 3296W-1-103LF; Operating Temperature: -55°C … 125°C; Series: 3296W; ( Series - Power - Value+Units Tolerance ): ( 3296W - 0,5 W - 10 kOhm ±10% ); Value Units: 10 kOhm
R11 R12 = CRCW120622K0JNEA: Manufacturer: Vishay Dale; Functional Analog Manufacturer: Yageo; Power: 0,25 W; Value: 22; Units: kOhm; Operating Voltage: 200 V; Value+Units: 22 kOhm; CommentDOC: ( CRCW - 1206 - 0,25 W - 22 kOhm  ±5% ); Functional Analog: RC1206JR-0722KL; Type: Резистор; ValueSCH: 22 k; Part Number: CRCW120622K0JNEA; Operating Temperature: -55°C ... 155°C; Series: CRCW
R13 = CRCW12064K02FKEA: Manufacturer: Vishay Dale; Functional Analog Manufacturer: Yageo; Tolerance: ±1%; Power: 0,25 W; Value: 4,02; Units: kOhm; Operating Voltage: 200 V; Value+Units: 4,02 kOhm; CommentDOC: ( CRCW - 1206 - 0,25 W - 4,02 kOhm  ±1% ); Functional Analog: RC1206FR-074K02L; Type: Резистор; ValueSCH: 4,02 k; Case: 1206; Part Number: CRCW12064K02FKEA; Operating Temperature: -55°C ... 155°C; Series: CRCW
R14 = CRCW120644K2FKEA: Manufacturer: Vishay Dale; Functional Analog Manufacturer: Yageo; Tolerance: ±1%; Power: 0,25 W; Value: 44,2; Units: kOhm; Operating Voltage: 200 V; Value+Units: 44,2 kOhm; CommentDOC: ( CRCW - 1206 - 0,25 W - 44,2 kOhm  ±1% ); Functional Analog: RC1206FR-0744K2L; Type: Резистор; ValueSCH: 44,2 k; Case: 1206; Part Number: CRCW120644K2FKEA; Operating Temperature: -55°C ... 155°C; Series: CRCW
R15 = CRCW1206453KFKEA: Manufacturer: Vishay Dale; Functional Analog Manufacturer: Yageo; Tolerance: ±1%; Power: 0,25 W; Value: 453; Units: kOhm; Operating Voltage: 200 V; Value+Units: 453 kOhm; CommentDOC: ( CRCW - 1206 - 0,25 W - 453 kOhm  ±1% ); Functional Analog: RC1206FR-07453KL; Type: Резистор; ValueSCH: 453 k; Case: 1206; Part Number: CRCW1206453KFKEA; Operating Temperature: -55°C ... 155°C; Series: CRCW
R16 = CRCW12064M53FKEA: Manufacturer: Vishay Dale; Functional Analog Manufacturer: Yageo; Tolerance: ±1%; Power: 0,25 W; Value: 4,53; Units: MOhm; Operating Voltage: 200 V; Value+Units: 4,53 MOhm; CommentDOC: ( CRCW - 1206 - 0,25 W - 4,53 MOhm  ±1% ); Functional Analog: RC1206FR-074M53L; Type: Резистор; ValueSCH: 4,53 M; Case: 1206; Part Number: CRCW12064M53FKEA; Operating Temperature: -55°C ... 155°C; Series: CRCW
R17 R22 R23 R28 R30-R32 = CRCW08050000Z0EA: Manufacturer: Vishay Dale; Functional Analog Manufacturer: Yageo; Power: 0,125 W; Units: Ohm; Operating Voltage: 150 V; Value+Units: 0 Ohm; CommentDOC: ( CRCW - 0805 - 0,125 W - 0 Ohm  Jumper ); Functional Analog: RC0805JR-070RL; Type: Резистор; ValueSCH: 0; Part Number: CRCW08050000Z0EA; Value: 0; Operating Temperature: -55°C ... 155°C; Series: CRCW
R18 = 3296W-1-102LF: Manufacturer: Bourns Inc.; Tolerance: ±10%; Power: 0,5 W; Value: 1; Units: kOhm; Value+Units: 1 kOhm; CommentDOC: ( 3296W - 0,5 W - 1 kOhm ±10% ); Type: Резистор; ValueSCH: 1 k; Part Number: 3296W-1-102LF; Operating Temperature: -55°C … 125°C; Series: 3296W; ( Series - Power - Value+Units Tolerance ): ( 3296W - 0,5 W - 1 kOhm ±10% ); Value Units: 1 kOhm
R19 = 3296W-1-103LF: Manufacturer: Bourns Inc.; Tolerance: ±10%; Power: 0,5 W; Value: 10; Units: kOhm; Value+Units: 10 kOhm; CommentDOC: ( 3296W - 0,5 W - 10 kOhm ±10% ); Type: Резистор; ValueSCH: 10 k; Part Number: 3296W-1-103LF; Operating Temperature: -55°C … 125°C; Series: 3296W; ( Series - Power - Value+Units Tolerance ): ( 3296W - 0,5 W - 10 kOhm ±10% ); Value Units: 10 kOhm
R20 = 3296W-1-104LF: Manufacturer: Bourns Inc.; Tolerance: ±10%; Power: 0,5 W; Value: 100; Units: kOhm; Value+Units: 100 kOhm; CommentDOC: ( 3296W - 0,5 W - 100 kOhm ±10% ); Type: Резистор; ValueSCH: 100 k; Part Number: 3296W-1-104LF; Operating Temperature: -55°C … 125°C; Series: 3296W; ( Series - Power - Value+Units Tolerance ): ( 3296W - 0,5 W - 100 kOhm ±10% ); Value Units: 100 kOhm
R21 = 3296W-1-105LF: Manufacturer: Bourns Inc.; Tolerance: ±10%; Power: 0,5 W; Value: 1; Units: MOhm; Value+Units: 1 MOhm; CommentDOC: ( 3296W - 0,5 W - 1 MOhm ±10% ); Type: Резистор; ValueSCH: 1 M; Part Number: 3296W-1-105LF; Operating Temperature: -55°C … 125°C; Series: 3296W; ( Series - Power - Value+Units Tolerance ): ( 3296W - 0,5 W - 1 MOhm ±10% ); Value Units: 1 MOhm
R24 R54 = CRCW120610K0FKEA: Manufacturer: Vishay Dale; Functional Analog Manufacturer: Yageo; Power: 0,25 W; Value: 10; Units: kOhm; Operating Voltage: 200 V; Value+Units: 10 kOhm; CommentDOC: ( CRCW - 1206 - 0,25 W - 10 kOhm  ±1% ); Functional Analog: RC1206FR-0710KL; Type: Резистор; ValueSCH: 10 k; Part Number: CRCW120610K0FKEA; Operating Temperature: -55°C ... 155°C; Series: CRCW
R25 R61 = CRCW12061K00FKEA: Manufacturer: Vishay Dale; Functional Analog Manufacturer: Yageo; Power: 0,25 W; Value: 1; Units: kOhm; Operating Voltage: 200 V; Value+Units: 1 kOhm; CommentDOC: ( CRCW - 1206 - 0,25 W - 1 kOhm  ±1% ); Functional Analog: RC1206FR-071KL; Type: Резистор; ValueSCH: 1 k; Part Number: CRCW12061K00FKEA; Operating Temperature: -55°C ... 155°C; Series: CRCW
R27 = CRCW120622K0FKEA: Manufacturer: Vishay Dale; Functional Analog Manufacturer: Yageo; Power: 0,25 W; Value: 22; Units: kOhm; Operating Voltage: 200 V; Value+Units: 22 kOhm; CommentDOC: ( CRCW - 1206 - 0,25 W - 22 kOhm  ±1% ); Functional Analog: RC1206FR-0722KL; Type: Резистор; ValueSCH: 22 k; Part Number: CRCW120622K0FKEA; Operating Temperature: -55°C ... 155°C; Series: CRCW
R29 = CRCW12062K20FKEA: Manufacturer: Vishay Dale; Functional Analog Manufacturer: Yageo; Power: 0,25 W; Value: 2,2; Units: kOhm; Operating Voltage: 200 V; Value+Units: 2,2 kOhm; CommentDOC: ( CRCW - 1206 - 0,25 W - 2,2 kOhm  ±1% ); Functional Analog: RC1206FR-072K2L; Type: Резистор; ValueSCH: 2,2 k; Part Number: CRCW12062K20FKEA; Operating Temperature: -55°C ... 155°C; Series: CRCW
R33 = CRCW120647R0JNEA: Manufacturer: Vishay Dale; Functional Analog Manufacturer: Yageo; Power: 0,25 W; Units: Ohm; Operating Voltage: 200 V; Value+Units: 47 Ohm; CommentDOC: ( CRCW - 1206 - 0,25 W - 47 Ohm  ±5% ); Functional Analog: RC1206JR-0747RL; Type: Резистор; ValueSCH: 47; Part Number: CRCW120647R0JNEA; Value: 47; Operating Temperature: -55°C ... 155°C; Series: CRCW
R34 R35 R38 R39 R55 R56 = CRCW12061K00JNEA: Manufacturer: Vishay Dale; Functional Analog Manufacturer: Yageo; Tolerance: ±5%; Power: 0,25 W; Value: 1; Units: kOhm; Operating Voltage: 200 V; Value+Units: 1 kOhm; CommentDOC: ( CRCW - 1206 - 0,25 W - 1 kOhm  ±5% ); Functional Analog: RC1206JR-071KL; Type: Резистор; ValueSCH: 1 k; Case: 1206; Part Number: CRCW12061K00JNEA; Operating Temperature: -55°C ... 155°C; Series: CRCW
R36 R42 R59 = 3296W-1-203LF: Manufacturer: Bourns Inc.; Power: 0,5 W; Value: 20; Units: kOhm; Value+Units: 20 kOhm; CommentDOC: ( 3296W - 0,5 W - 20 kOhm ±10% ); Type: Резистор; ValueSCH: 20 k; Part Number: 3296W-1-203LF; Operating Temperature: -55°C … 125°C; Series: 3296W; ( Series - Power - Value+Units Tolerance ): ( 3296W - 0,5 W - 20 kOhm ±10% ); Value Units: 20 kOhm
R37 = CRCW1206100RJNEA: Manufacturer: Vishay Dale; Functional Analog Manufacturer: Yageo; Power: 0,25 W; Units: Ohm; Operating Voltage: 200 V; Value+Units: 100 Ohm; CommentDOC: ( CRCW - 1206 - 0,25 W - 100 Ohm  ±5% ); Functional Analog: RC1206JR-07100RL; Type: Резистор; ValueSCH: 100; Part Number: CRCW1206100RJNEA; Value: 100; Operating Temperature: -55°C ... 155°C; Series: CRCW
R40 R52 = CRCW08051K00JNEA: Manufacturer: Vishay Dale; Functional Analog Manufacturer: Yageo; Power: 0,125 W; Value: 1; Units: kOhm; Operating Voltage: 150 V; Value+Units: 1 kOhm; CommentDOC: ( CRCW - 0805 - 0,125 W - 1 kOhm  ±5% ); Functional Analog: RC0805JR-071KL; Type: Резистор; ValueSCH: 1 k; Part Number: CRCW08051K00JNEA; Operating Temperature: -55°C ... 155°C; Series: CRCW
R41 R50 = CRCW080510K0JNEA: Manufacturer: Vishay Dale; Functional Analog Manufacturer: Yageo; Power: 0,125 W; Value: 10; Units: kOhm; Operating Voltage: 150 V; Value+Units: 10 kOhm; CommentDOC: ( CRCW - 0805 - 0,125 W - 10 kOhm  ±5% ); Functional Analog: RC0805JR-0710KL; Type: Резистор; ValueSCH: 10 k; Part Number: CRCW080510K0JNEA; Operating Temperature: -55°C ... 155°C; Series: CRCW
R43 = CRCW120610M0FKEA: Manufacturer: Vishay Dale; Functional Analog Manufacturer: Yageo; Power: 0,25 W; Value: 10; Units: MOhm; Operating Voltage: 200 V; Value+Units: 10 MOhm; CommentDOC: ( CRCW - 1206 - 0,25 W - 10 MOhm  ±1% ); Functional Analog: RC1206FR-0710ML; Type: Резистор; ValueSCH: 10 M; Part Number: CRCW120610M0FKEA; Operating Temperature: -55°C ... 155°C; Series: CRCW
R44 R60 = CRCW120651K0JNEA: Manufacturer: Vishay Dale; Functional Analog Manufacturer: Yageo; Power: 0,25 W; Value: 51; Units: kOhm; Operating Voltage: 200 V; Value+Units: 51 kOhm; CommentDOC: ( CRCW - 1206 - 0,25 W - 51 kOhm  ±5% ); Functional Analog: RC1206JR-0751KL; Type: Резистор; ValueSCH: 51 k; Part Number: CRCW120651K0JNEA; Operating Temperature: -55°C ... 155°C; Series: CRCW
R45 R49 = CRCW120615K0FKEA: Manufacturer: Vishay Dale; Functional Analog Manufacturer: Yageo; Power: 0,25 W; Value: 15; Units: kOhm; Operating Voltage: 200 V; Value+Units: 15 kOhm; CommentDOC: ( CRCW - 1206 - 0,25 W - 15 kOhm  ±1% ); Functional Analog: RC1206FR-0715KL; Type: Резистор; ValueSCH: 15 k; Part Number: CRCW120615K0FKEA; Operating Temperature: -55°C ... 155°C; Series: CRCW
R46 = 3296W-1-202LF: Manufacturer: Bourns Inc.; Power: 0,5 W; Value: 2; Units: kOhm; Value+Units: 2 kOhm; CommentDOC: ( 3296W - 0,5 W - 2 kOhm ±10% ); Type: Резистор; ValueSCH: 2 k; Part Number: 3296W-1-202LF; Operating Temperature: -55°C … 125°C; Series: 3296W; ( Series - Power - Value+Units Tolerance ): ( 3296W - 0,5 W - 2 kOhm ±10% ); Value Units: 2 kOhm
R47 = CRCW12061M00FKEA: Manufacturer: Vishay Dale; Functional Analog Manufacturer: Yageo; Power: 0,25 W; Value: 1; Units: MOhm; Operating Voltage: 200 V; Value+Units: 1 MOhm; CommentDOC: ( CRCW - 1206 - 0,25 W - 1 MOhm  ±1% ); Functional Analog: RC1206FR-071ML; Type: Резистор; ValueSCH: 1 M; Part Number: CRCW12061M00FKEA; Operating Temperature: -55°C ... 155°C; Series: CRCW
R48 = CRCW1206100KFKEA: Manufacturer: Vishay Dale; Functional Analog Manufacturer: Yageo; Tolerance: ±1%; Power: 0,25 W; Value: 100; Units: kOhm; Operating Voltage: 200 V; Value+Units: 100 kOhm; CommentDOC: ( CRCW - 1206 - 0,25 W - 100 kOhm  ±1% ); Functional Analog: RC1206FR-07100KL; Type: Резистор; ValueSCH: 100 k; Case: 1206; Part Number: CRCW1206100KFKEA; Operating Temperature: -55°C ... 155°C; Series: CRCW
R51 = CRCW12067K50JNEA: Manufacturer: Vishay Dale; Functional Analog Manufacturer: Yageo; Power: 0,25 W; Value: 7,5; Units: kOhm; Operating Voltage: 200 V; Value+Units: 7,5 kOhm; CommentDOC: ( CRCW - 1206 - 0,25 W - 7,5 kOhm  ±5% ); Functional Analog: RC1206JR-077K5L; Type: Резистор; ValueSCH: 7,5 k; Part Number: CRCW12067K50JNEA; Operating Temperature: -55°C ... 155°C; Series: CRCW
R53 R58 = 3296W-1-502LF: Manufacturer: Bourns Inc.; Power: 0,5 W; Value: 5; Units: kOhm; Value+Units: 5 kOhm; CommentDOC: ( 3296W - 0,5 W - 5 kOhm ±10% ); Type: Резистор; ValueSCH: 5 k; Part Number: 3296W-1-502LF; Operating Temperature: -55°C … 125°C; Series: 3296W; ( Series - Power - Value+Units Tolerance ): ( 3296W - 0,5 W - 5 kOhm ±10% ); Value Units: 5 kOhm
R57 = CRCW12066K80JNEA: Manufacturer: Vishay Dale; Functional Analog Manufacturer: Yageo; Power: 0,25 W; Value: 6,8; Units: kOhm; Operating Voltage: 200 V; Value+Units: 6,8 kOhm; CommentDOC: ( CRCW - 1206 - 0,25 W - 6,8 kOhm  ±5% ); Functional Analog: RC1206JR-076K8L; Type: Резистор; ValueSCH: 6,8 k; Part Number: CRCW12066K80JNEA; Operating Temperature: -55°C ... 155°C; Series: CRCW
R63 = CRCW12062K00JNEA: Manufacturer: Vishay Dale; Functional Analog Manufacturer: Yageo; Power: 0,25 W; Value: 2; Units: kOhm; Operating Voltage: 200 V; Value+Units: 2 kOhm; CommentDOC: ( CRCW - 1206 - 0,25 W - 2 kOhm  ±5% ); Functional Analog: RC1206JR-072KL; Type: Резистор; ValueSCH: 2 k; Part Number: CRCW12062K00JNEA; Operating Temperature: -55°C ... 155°C; Series: CRCW
R64 = CRCW12061K00JNEA: Manufacturer: Vishay Dale; Functional Analog Manufacturer: Yageo; Power: 0,25 W; Value: 1; Units: kOhm; Operating Voltage: 200 V; Value+Units: 1 kOhm; CommentDOC: ( CRCW - 1206 - 0,25 W - 1 kOhm  ±5% ); Functional Analog: RC1206JR-071KL; Type: Резистор; ValueSCH: 1 k; Part Number: CRCW12061K00JNEA; Operating Temperature: -55°C ... 155°C; Series: CRCW
R65 = 3296W-1-253LF: Manufacturer: Bourns Inc.; Power: 0,5 W; Value: 10; Units: kOhm; Value+Units: 25 kOhm; CommentDOC: ( 3296W - 0,5 W - 25 kOhm ±10% ); Type: Резистор; ValueSCH: 10 k; Part Number: 3296W-1-253LF; Operating Temperature: -55°C … 125°C; Series: 3296W; ( Series - Power - Value+Units Tolerance ): ( 3296W - 0,5 W - 25 kOhm ±10% ); Value Units: 25 kOhm
R66 = CRCW1206100RFKEA: Manufacturer: Vishay Dale; Functional Analog Manufacturer: Yageo; Power: 0,25 W; Units: Ohm; Operating Voltage: 200 V; Value+Units: 100 Ohm; CommentDOC: ( CRCW - 1206 - 0,25 W - 100 Ohm  ±1% ); Functional Analog: RC1206FR-07100RL; Type: Резистор; ValueSCH: 100; Part Number: CRCW1206100RFKEA; Value: 100; Operating Temperature: -55°C ... 155°C; Series: CRCW
T1 = TH30/12G-1.8VA-2x15V: Specification: ДСТУ IEC 61558-2-1; ValueSCH: 220V-2x15V 50Hz; Part Number: TH30/12G-1.8VA-2x15V; Series: TH30/12G; Case: TH30/12G; Operating Temperature: ... 70°C ГОСТ 8865
VD1 = DB107S: Part Number: DB107S; Voltage Revers: 1000V; Current: 1:00; ValueSCH: DB107S; Case: DB-S; Operating Temperature: -55°C ... 155°C
VD2-VD6 = LL4148: Manufacturer: ON Semiconductor; Type: Диод; Voltage Revers: 100 V; Current: 200 mA; Part Number: LL4148; ValueSCH: LL4148; Case: SOD-80; Operating Temperature: -55°C ... 175°C
VT1 VT2 = BC847: Part Number: BC847; Manufacturer: ON Semiconductor; Type: Транзистор; Uce max: 45 V; Ice max: 100 mA; Total Power Dissipation: 310 mW; DC Current Gain: 110…800; F max: 300 MHz; ValueSCH: BC848; Operating Temperature: -65°C …  150°C
VT3 VT4 = PMBFJ309: Manufacturer: NXP Semiconductors; ValueSCH: PMBFJ310; D-S Voltage max: ±25 V; Drain Current max: 30 mA; Total Power Dissipation: 250mW; Rds On (Max): 50 Ohm; Vgs (Max): -25 V; Gate Threshold Voltage: -4 V max; Input Capacitance: 1,1 pF; Part Number: PMBFJ309; Operating Temperature: -65°C ... 150°C
XP1 = 61300311121: Manufacturer: Würth Elektronik; Pitch: 2,54 mm; Functional Analog: PLS-3; Type: Вилка; Part Number: 61300311121; Series: WE-PHD; Number of Pins: 3; Operating Temperature: −40°C ... 105°C
XP2 = 61900311121: Manufacturer: Würth Elektronik; Pitch: 2,54 mm; Functional Analog: WF-3; Type: Вилка; Part Number: 61900311121; Series: WE-WTB; Number of Pins: 3; Operating Temperature: −40°C ... 105°C
XP3 XP11 = 61300711121: Manufacturer: Würth Elektronik; Pitch: 2,54 mm; Functional Analog: PLS-7; Type: Вилка; Part Number: 61300711121; Series: WE-PHD; Number of Pins: 7; Operating Temperature: −40°C ... 105°C
XP4 = 61300511121: Manufacturer: Würth Elektronik; Pitch: 2,54 mm; Functional Analog: PLS-5; Type: Вилка; Part Number: 61300511121; Series: WE-PHD; Number of Pins: 5; Operating Temperature: −40°C ... 105°C
XP5-XP10 = 61300211121: Manufacturer: Würth Elektronik; Pitch: 2,54 mm; Functional Analog: PLS-2; Type: Вилка; Part Number: 61300211121; Series: WE-PHD; Number of Pins: 2; Operating Temperature: −40°C ... 105°C